# EAGLE design RectifierPartOne (EAGLE 9.6.2)
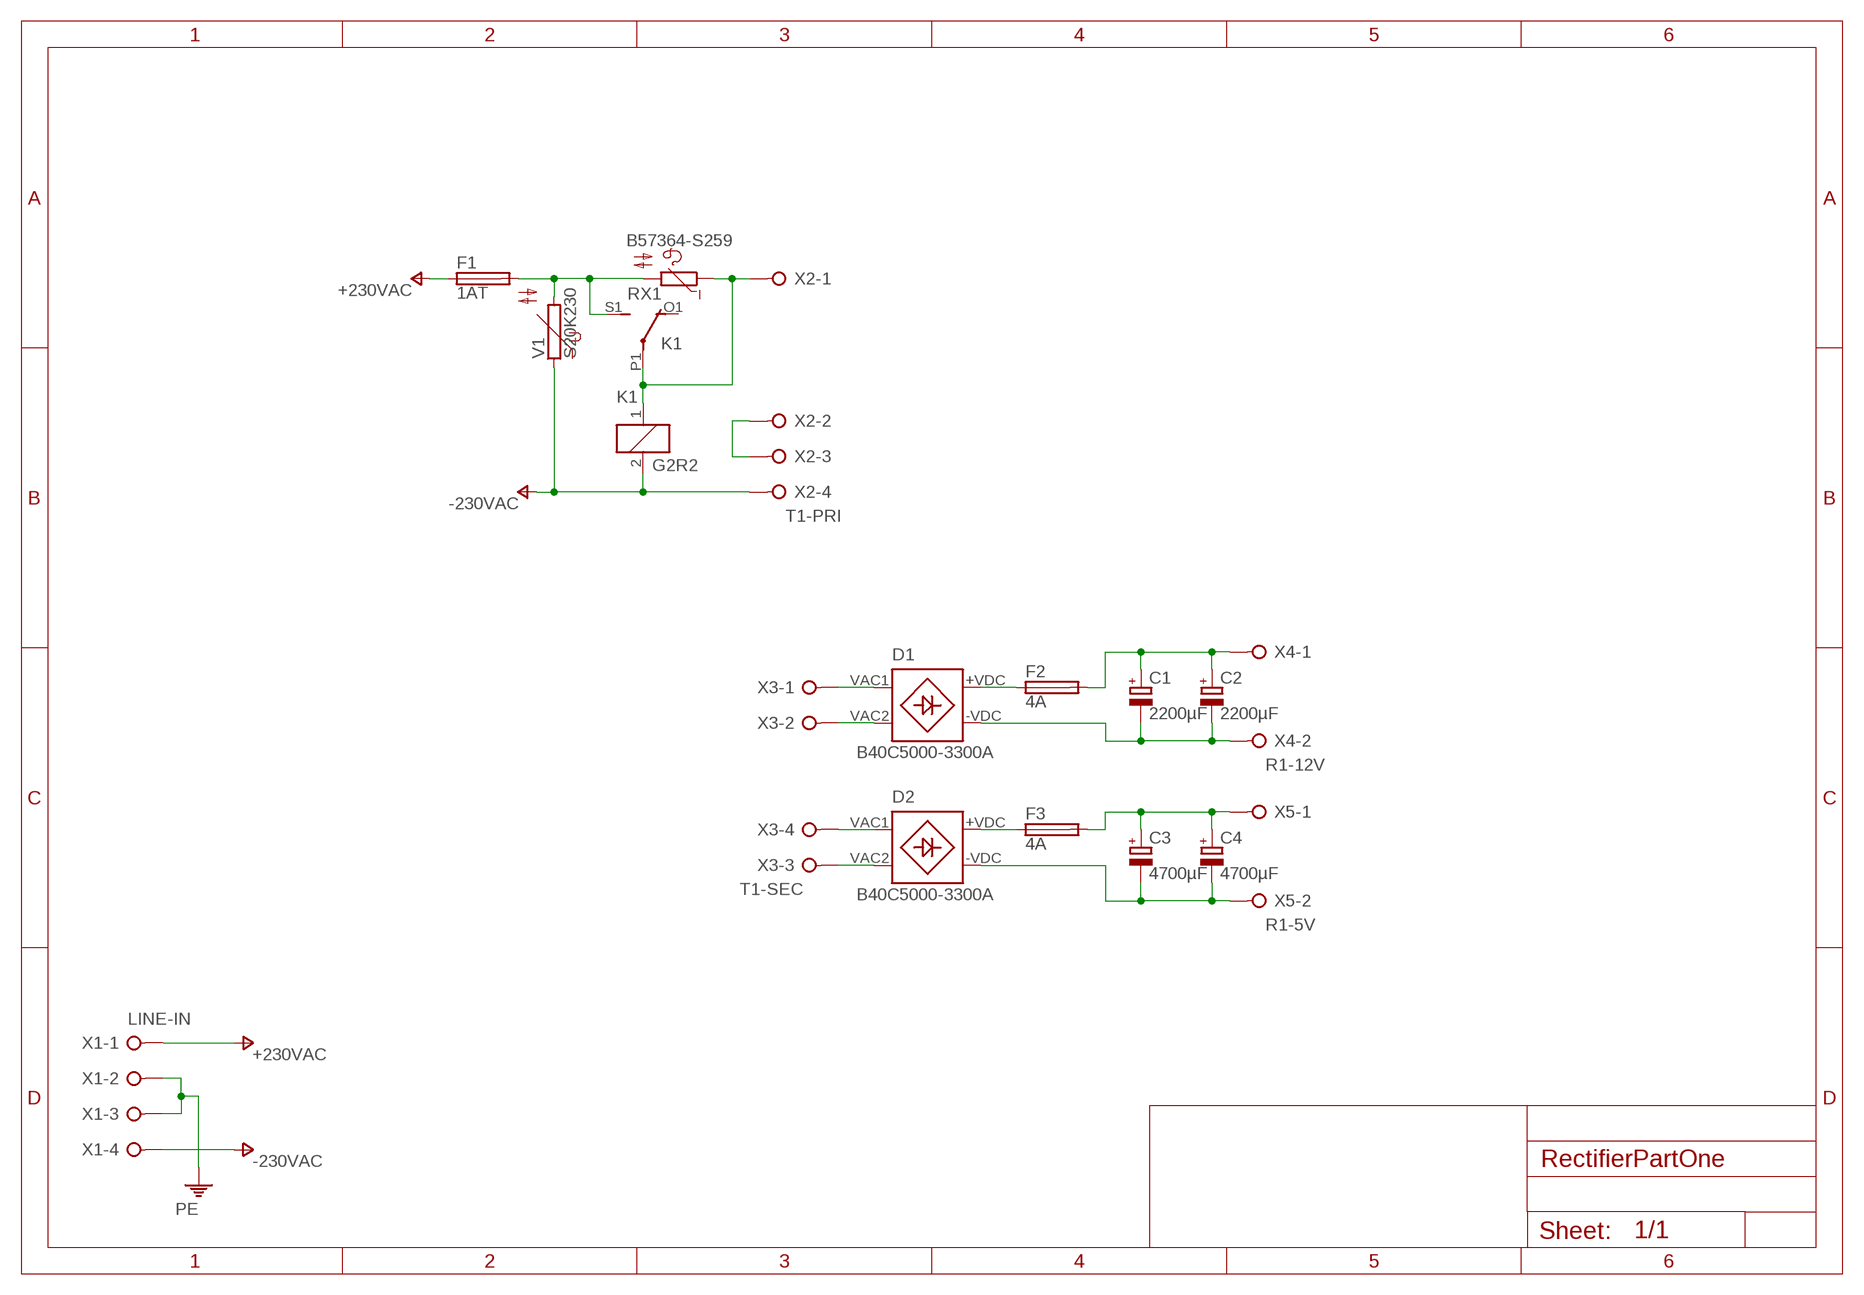
[diagram p0: schematic, sheet 1]

## Parts
C1  2200µF  CPOL-EUE7.5-16  [E7,5-16]
C2  2200µF  CPOL-EUE7.5-16  [E7,5-16]
C3  4700µF  CPOL-EUE7.5-16  [E7,5-16]
C4  4700µF  CPOL-EUE7.5-16  [E7,5-16]
D1  B40C5000-3300A  [B..C]
D2  B40C5000-3300A  [B..C]
F1  1AT  SH22,5A  [SH22,5A]
F2  4A  SH22,5A  [SH22,5A]
F3  4A  SH22,5A  [SH22,5A]
K1  G2R2  [G2R2]
RX1  B57364-S259  EPCB57364-S259  [B57364S0]
V1  S20K230  [S20K230]
X1  LINE-IN  W237-04P  [W237-4P]
X2  T1-PRI  W237-04P  [W237-4P]
X3  T1-SEC  W237-04P  [W237-4P]
X4  R1-12V  W237-02P  [W237-132]
X5  R1-5V  W237-02P  [W237-132]

## Nets
+230VAC: F1.1 X1.1
-230VAC: K1.2 V1.1 X1.4 X2.4
N$1: D1.VAC1 X3.1
N$2: K1.1 K1.P1(2:P) RX1.P$1 X2.1
N$3: F1.2 K1.S1(2:S) RX1.P$2 V1.2
N$4: C1.+ C2.+ F2.2 X4.1
N$5: X2.2 X2.3
N$6: C3.+ C4.+ F3.2 X5.1
N$7: C1.- C2.- D1.-VDC X4.2
N$8: D2.VAC1 X3.4
N$9: C3.- C4.- D2.-VDC X5.2
N$10: D1.+VDC F2.1
N$11: D2.+VDC F3.1
N$12: D1.VAC2 X3.2
N$13: D2.VAC2 X3.3
PE: X1.2 X1.3
Unconnected: K1.O1(2:O) K1.O2(3:O) K1.P2(3:P) K1.S2(3:S)

## Library data of the parts
C1-C4 = rcl:CPOL-EU: POLARIZED CAPACITOR, European symbol; SPICEPREFIX: C
D1 D2 = bb84:B40C5000-3300A: Allgemeines Ausführung: Silizium-Brückengleichrichter Bauform: Standard -WW+ Modell: B40C Elektrische Werte Eingangsspannung: 40VAC Nennstrom: 5A URRM: 80V Maße Breite: 32mm Höhe: 17mm Tiefe: 5,6mm Herstellerangaben Hersteller: DIOTEC Artikelnummer des Herstellers: B40C5000-3300A Verpackungsgewicht: 0.007kg RoHS: konform EAN/GTIN: 9900002169822
F1-F3 = fuse:SH22,5A: FUSE HOLDER grid 22,5mm, isolated cap OGN0031 8201, Schurter (Buerklin); MPN: 0031.7701.11; OC_FARNELL: unknown; OC_NEWARK: 04F1224
K1 = relay:G2R2: RELAY 2 x switch, Omron; MF: OMRON COMPONENTS USA; MPN: G2R-2-DC6; OC_FARNELL: unknown; OC_NEWARK: 89C5317
RX1 = bb84:EPCB57364-S259
V1 = varistor:S20K230: VARISTOR
X1-X3 = con-wago-508:W237-04P: WAGO SREW CLAMP; OC_FARNELL: unknown; OC_NEWARK: unknown
X4 X5 = con-wago-508:W237-02P: WAGO SREW CLAMP; OC_FARNELL: unknown; OC_NEWARK: unknown

## Board
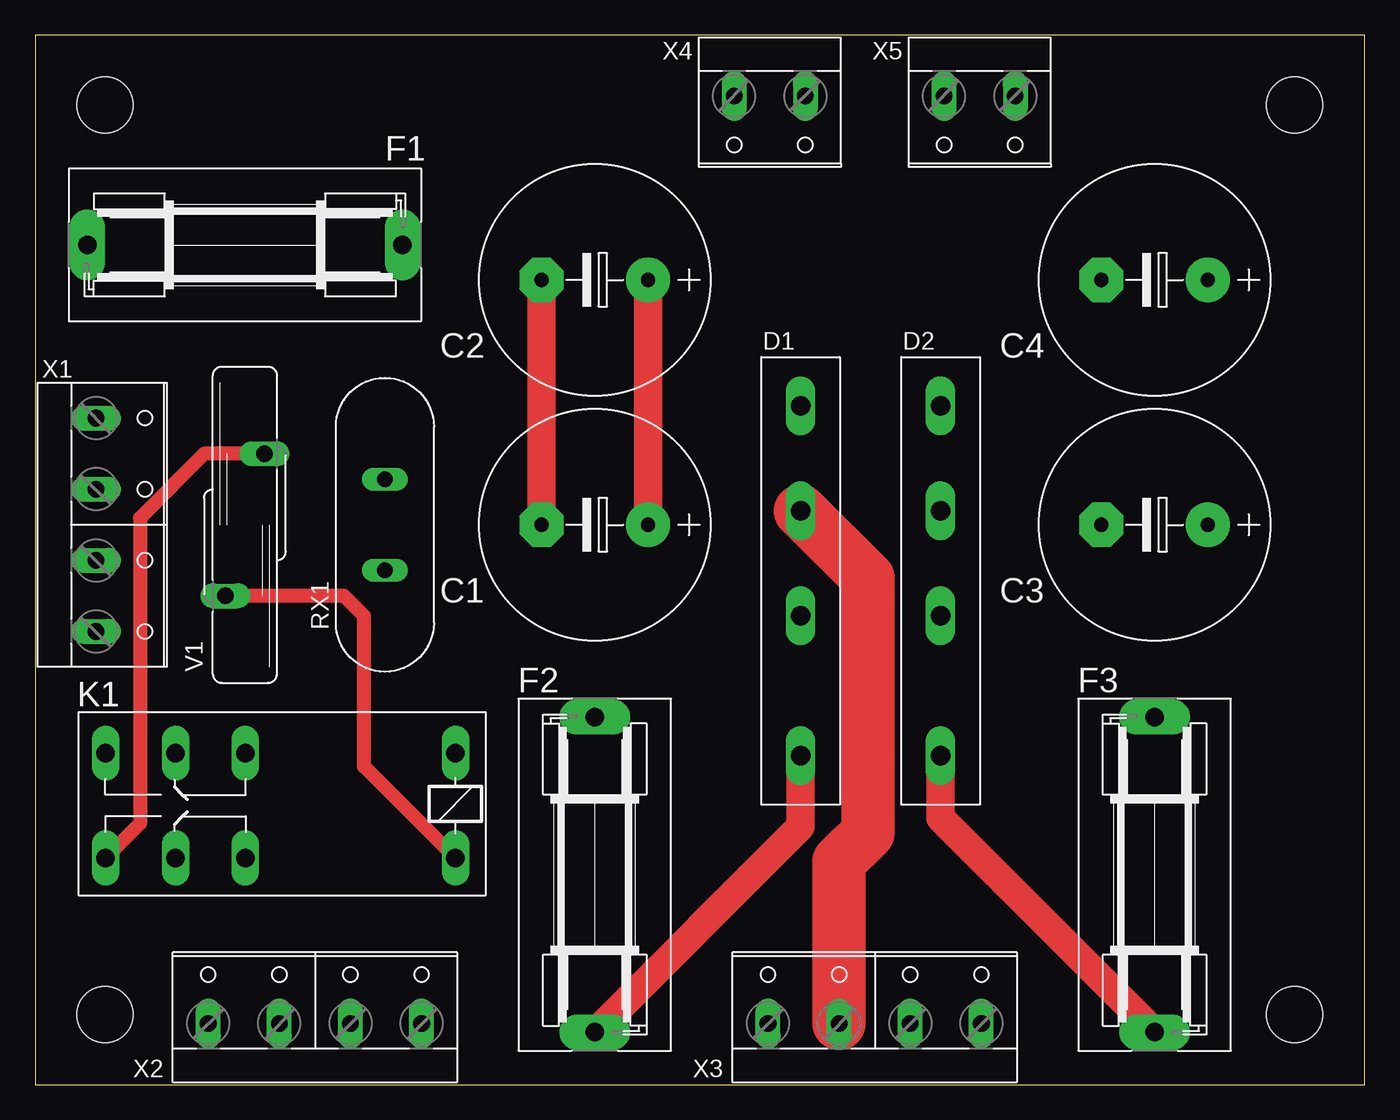
[diagram p1: board, top side]
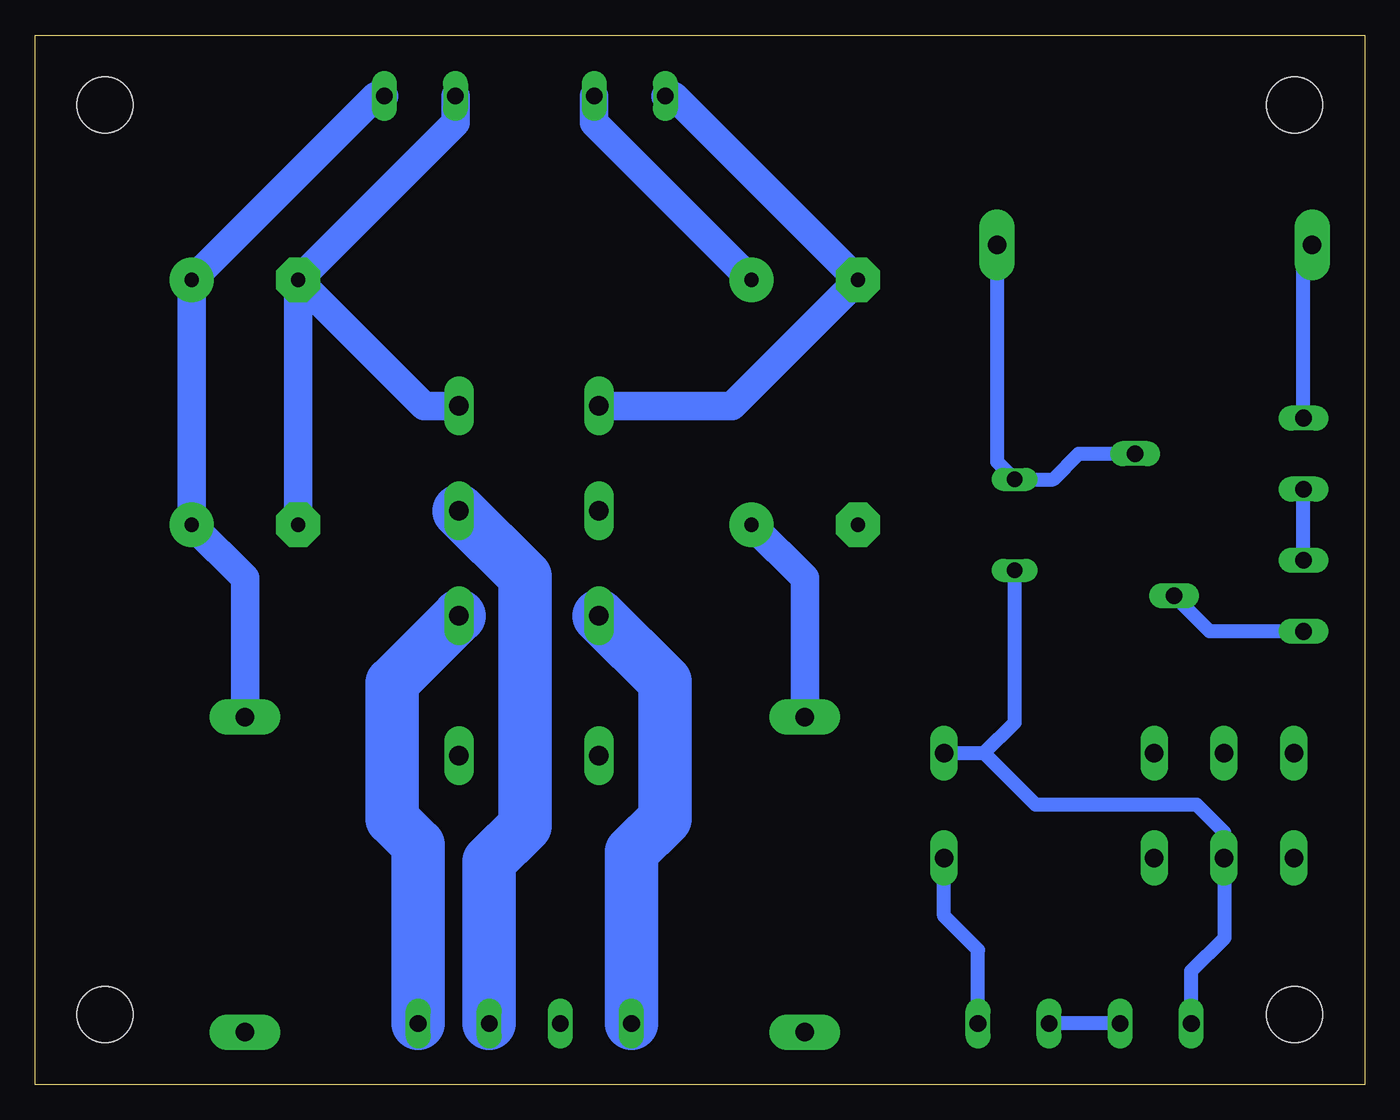
[diagram p2: board, bottom side, seen from below]

Size 95 x 75 mm. Coordinates in mm from the lower left corner, seen from the top.
Outline: 0,0 95,0 95,75 0,75 0,0
Copper layers (1*16): Top 0.035mm / dielectric 1.5mm / Bottom 0.035mm
Design rules "default *": minimum track width 40mil, minimum drill 0.35mm, track to track 10mil, track to pad 10mil, pad to pad 10mil, via to via 10mil, smd to smd 6mil, copper to edge 40mil, drill to drill 6mil, minimum pad ring 10mil, minimum via ring 8mil, stop-mask expansion 4mil, vias tented up to drill 0mil, thermal gap 10mil
Holes 4 mm at 5,5 5,70 90,70 90,5

### Footprints (pad centres in the part's own frame; a part is rotated, then mirrored left to right if it is on the bottom)
E7,5-16 = drill 1.016 pad 3.15: + -3.81,0 | drill 1.016 pad 3.15 octagon: - 3.81,0
B..C = drill 1.4 long: +VDC 3.5,2.8; -VDC 28.5,2.8; VAC1 13.5,2.8; VAC2 21,2.8
SH22,5A = drill 1.321 pad 2.54 long: 1 -11.252,0; 2 11.252,0
G2R2 = drill 1.321 long: 1 -2.54,-3.683; 2 -2.54,3.81; O1 12.471,3.81; O2 12.471,-3.683; P1 17.45,3.81; P2 17.45,-3.683; S1 22.454,3.81; S2 22.454,-3.683
B57364S0 = drill 1.1 long: P$1 -3.25,0; P$2 3.25,0
S20K230 = drill 1.194 long: 1 -1.397,-5.08; 2 1.397,5.08
W237-4P = drill 1.194 long: 1 -7.62,-0.635; 2 -2.54,-0.635; 3 2.54,-0.635; 4 7.62,-0.635
W237-132 = drill 1.194 long: 1 -2.54,-0.635; 2 2.54,-0.635

### Placement (x,y rotation side)
C1  40,40 180 top
C2  40,57.5 180 top
C3  80,40 180 top
C4  80,57.5 180 top
D1  57.5,20 90 top
D2  67.5,20 90 top
F1  15,60 0 top
F2  40,15 90 top
F3  80,15 90 top
K1  27.5,20 180 top
RX1  25,40 90 top
V1  15,40 0 top
X1  5,40 270 top
X2  20,5 0 top
X3  60,5 0 top
X4  52.5,70 180 top
X5  67.5,70 180 top

### Tracks (layer width: path | path; a pad name or v marks a point on that pad's centre or on a via)
+230VAC
  Bottom 1.016: X1.1 4.37,59.38 F1.1
-230VAC
  Top 1.016: K1.2 23.5,22.73 23.5,33.5 22.08,34.92 V1.1
  Bottom 1.016: X1.4 11.06,32.38 V1.1 | X2.4 27.62,9.62 30.04,12.04 K1.2
N$1
  Bottom 3.81: X3.1 52.38,16.62 50,19 50,28.8 D1.VAC1
N$2
  Bottom 1.016: X2.1 12.38,8.12 10,10.5 10,16.14 K1.P1 10.05,18.05 12,20 23.5,20 27.18,23.68 | K1.1 27.18,23.68 | 27.18,23.68 25,25.87 RX1.P$1
N$3
  Top 1.016: V1.2 12.08,45.08 7.5,40.5 7.5,18.64 K1.S1
  Bottom 1.016: F1.2 26.25,44.5 RX1.P$2 22.25,43.25 20.42,45.08 V1.2
N$4
  Top 2.032: C2.+ C1.+
  Bottom 2.032: C2.+ 55.04,68.73 X4.1 | F2.2 40,36.19 C1.+
N$5
  Bottom 1.016: X2.2 X2.3
N$6
  Bottom 2.032: X5.1 70.67,70.64 C4.+ C3.+ 80,36.19 F3.2
N$7
  Top 2.032: C1.- C2.-
  Bottom 2.032: D1.-VDC 45.19,48.5 C2.- 49.33,70.64 X4.2
N$8
  Bottom 3.81: X3.4 67.62,17.12 69.5,19 69.5,28.7 D2.VAC1
N$9
  Bottom 2.032: C4.- 67.19,48.5 D2.-VDC | C4.- 64.96,68.73 X5.2 | C4.- C3.-
N$10
  Top 2.032: F2.1 54.7,18.45 D1.+VDC
N$11
  Top 2.032: F3.1 64.7,19.05 D2.+VDC
N$12
  Top 3.81: D1.VAC2 59.5,36.2 59.5,18 57.46,15.96 X3.2
N$13
  Bottom 3.81: D2.VAC2 60,36.3 60,18.5 62.54,15.96 X3.3
PE
  Bottom 1.016: X1.3 X1.2